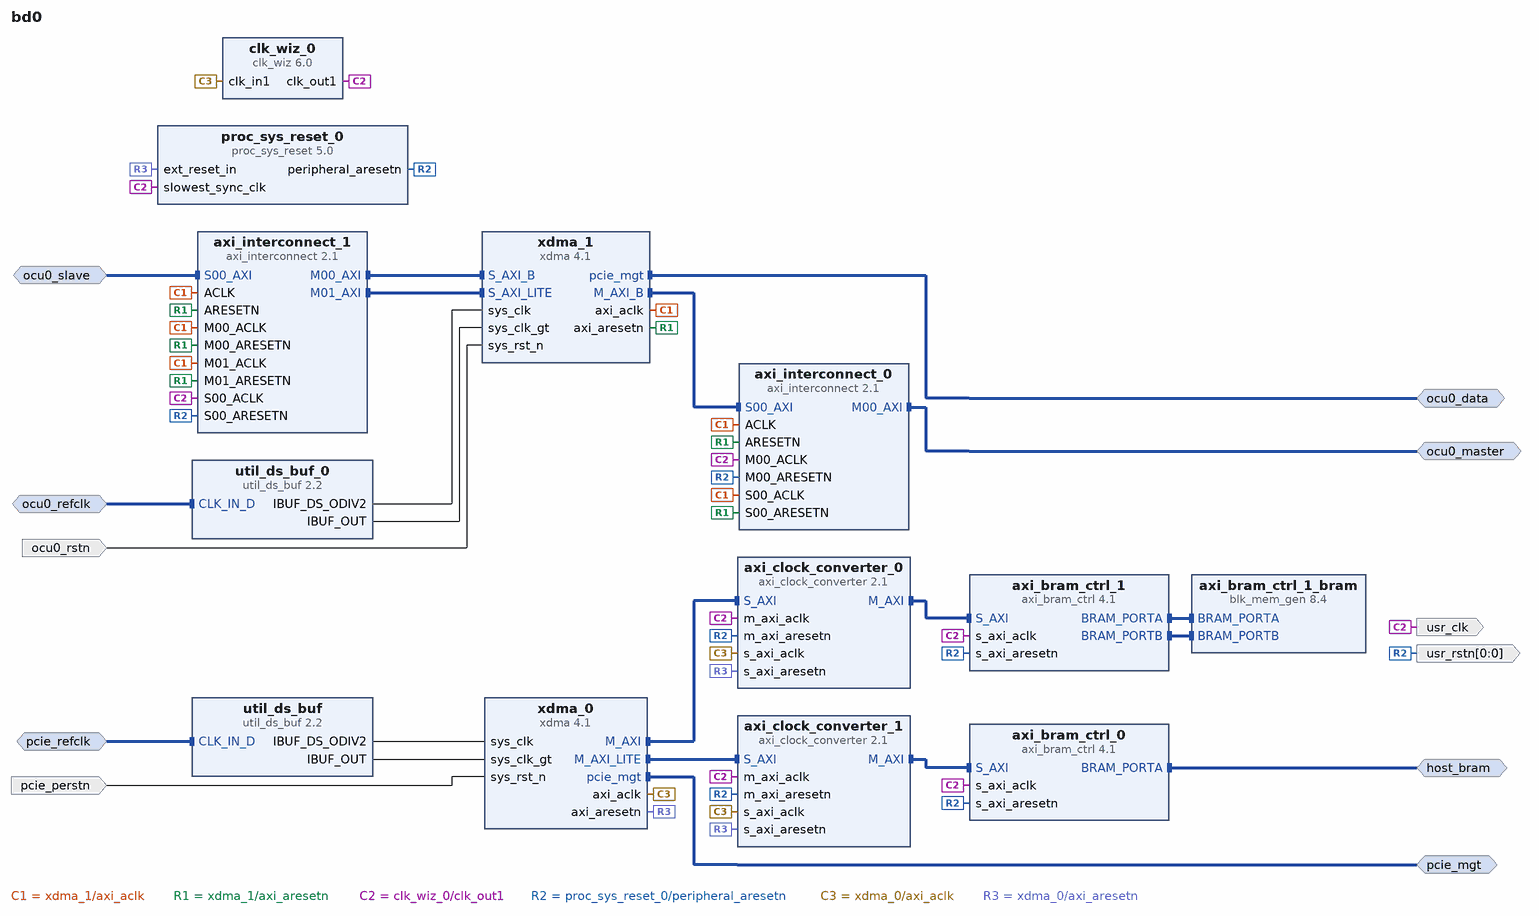
[diagram p0: block diagram of the top level]
# Vivado block design bd0, xczu19eg-ffvd1760-2-e, Vivado 2021.2
create_bd_design bd0

create_bd_intf_port -mode Master -vlnv xilinx.com:interface:pcie_7x_mgt_rtl:1.0 pcie_mgt
create_bd_intf_port -mode Master -vlnv xilinx.com:interface:bram_rtl:1.0 host_bram
set_property -dict {CONFIG.MASTER_TYPE BRAM_CTRL CONFIG.READ_WRITE_MODE READ_WRITE} [get_bd_intf_ports host_bram]
create_bd_intf_port -mode Master -vlnv xilinx.com:interface:pcie_7x_mgt_rtl:1.0 ocu0_data
create_bd_intf_port -mode Master -vlnv xilinx.com:interface:aximm_rtl:1.0 ocu0_master
set_property -dict [list \
  CONFIG.ADDR_WIDTH 64 \
  CONFIG.DATA_WIDTH 128 \
  CONFIG.FREQ_HZ 250000000 \
  CONFIG.HAS_BURST 0 \
  CONFIG.HAS_QOS 0 \
  CONFIG.HAS_REGION 0 \
  CONFIG.NUM_READ_OUTSTANDING 8 \
  CONFIG.NUM_WRITE_OUTSTANDING 8 \
  CONFIG.PROTOCOL AXI4 \
] [get_bd_intf_ports ocu0_master]
create_bd_intf_port -mode Slave -vlnv xilinx.com:interface:aximm_rtl:1.0 ocu0_slave
set_property -dict [list \
  CONFIG.ADDR_WIDTH 64 \
  CONFIG.ARUSER_WIDTH 0 \
  CONFIG.AWUSER_WIDTH 0 \
  CONFIG.BUSER_WIDTH 0 \
  CONFIG.DATA_WIDTH 128 \
  CONFIG.FREQ_HZ 250000000 \
  CONFIG.HAS_BRESP 1 \
  CONFIG.HAS_BURST 1 \
  CONFIG.HAS_CACHE 0 \
  CONFIG.HAS_LOCK 0 \
  CONFIG.HAS_PROT 0 \
  CONFIG.HAS_QOS 0 \
  CONFIG.HAS_REGION 1 \
  CONFIG.HAS_RRESP 1 \
  CONFIG.HAS_WSTRB 1 \
  CONFIG.ID_WIDTH 4 \
  CONFIG.MAX_BURST_LENGTH 256 \
  CONFIG.NUM_READ_OUTSTANDING 8 \
  CONFIG.NUM_READ_THREADS 1 \
  CONFIG.NUM_WRITE_OUTSTANDING 8 \
  CONFIG.NUM_WRITE_THREADS 1 \
  CONFIG.PROTOCOL AXI4 \
  CONFIG.READ_WRITE_MODE READ_WRITE \
  CONFIG.RUSER_BITS_PER_BYTE 0 \
  CONFIG.RUSER_WIDTH 0 \
  CONFIG.SUPPORTS_NARROW_BURST 1 \
  CONFIG.WUSER_BITS_PER_BYTE 0 \
  CONFIG.WUSER_WIDTH 0 \
] [get_bd_intf_ports ocu0_slave]
create_bd_intf_port -mode Slave -vlnv xilinx.com:interface:diff_clock_rtl:1.0 pcie_refclk
set_property -dict {CONFIG.FREQ_HZ 100000000} [get_bd_intf_ports pcie_refclk]
create_bd_intf_port -mode Slave -vlnv xilinx.com:interface:diff_clock_rtl:1.0 ocu0_refclk
create_bd_port -dir I -type rst pcie_perstn
set_property -dict {CONFIG.POLARITY ACTIVE_LOW} [get_bd_ports pcie_perstn]
create_bd_port -dir I -type rst ocu0_rstn
create_bd_port -dir O -type clk usr_clk
set_property -dict {CONFIG.FREQ_HZ 250000000} [get_bd_ports usr_clk]
create_bd_port -dir O -from 0 -to 0 -type rst usr_rstn

create_bd_cell -type ip -vlnv xilinx.com:ip:xdma:4.1 xdma_0
set_property -dict [list \
  CONFIG.axi_data_width 512_bit \
  CONFIG.axilite_master_en true \
  CONFIG.axisten_freq 250 \
  CONFIG.pl_link_cap_max_link_speed 8.0_GT/s \
  CONFIG.pl_link_cap_max_link_width X16 \
  CONFIG.xdma_axi_intf_mm AXI_Memory_Mapped \
] [get_bd_cells xdma_0]
create_bd_cell -type ip -vlnv xilinx.com:ip:util_ds_buf:2.2 util_ds_buf
set_property -dict {CONFIG.C_BUF_TYPE IBUFDSGTE} [get_bd_cells util_ds_buf]
create_bd_cell -type ip -vlnv xilinx.com:ip:axi_bram_ctrl:4.1 axi_bram_ctrl_0
set_property -dict {CONFIG.PROTOCOL AXI4LITE CONFIG.SINGLE_PORT_BRAM 1} [get_bd_cells axi_bram_ctrl_0]
create_bd_cell -type ip -vlnv xilinx.com:ip:axi_bram_ctrl:4.1 axi_bram_ctrl_1
set_property -dict {CONFIG.DATA_WIDTH 512} [get_bd_cells axi_bram_ctrl_1]
create_bd_cell -type ip -vlnv xilinx.com:ip:blk_mem_gen:8.4 axi_bram_ctrl_1_bram
set_property -dict {CONFIG.Memory_Type True_Dual_Port_RAM} [get_bd_cells axi_bram_ctrl_1_bram]
create_bd_cell -type ip -vlnv xilinx.com:ip:xdma:4.1 xdma_1
set_property -dict [list \
  CONFIG.BASEADDR 0x00000000 \
  CONFIG.HIGHADDR 0x001FFFFF \
  CONFIG.PF0_DEVICE_ID_mqdma 9034 \
  CONFIG.PF0_SRIOV_VF_DEVICE_ID A034 \
  CONFIG.PF2_DEVICE_ID_mqdma 9234 \
  CONFIG.PF3_DEVICE_ID_mqdma 9334 \
  CONFIG.axi_addr_width 64 \
  CONFIG.axi_data_width 128_bit \
  CONFIG.axibar_num 1 \
  CONFIG.axisten_freq 250 \
  CONFIG.bridge_burst true \
  CONFIG.c_m_axi_num_write 8 \
  CONFIG.device_port_type Root_Port_of_PCI_Express_Root_Complex \
  CONFIG.dma_reset_source_sel Phy_Ready \
  CONFIG.en_axi_slave_if true \
  CONFIG.en_gt_selection false \
  CONFIG.functional_mode AXI_Bridge \
  CONFIG.mode_selection Basic \
  CONFIG.pcie_blk_locn X0Y3 \
  CONFIG.pf0_bar0_enabled false \
  CONFIG.pf0_bar0_type_mqdma Memory \
  CONFIG.pf0_base_class_menu Bridge_device \
  CONFIG.pf0_base_class_menu_mqdma Bridge_device \
  CONFIG.pf0_class_code_base_mqdma 06 \
  CONFIG.pf0_class_code_interface 00 \
  CONFIG.pf0_class_code_sub 07 \
  CONFIG.pf0_device_id 9134 \
  CONFIG.pf0_link_status_slot_clock_config true \
  CONFIG.pf0_sriov_bar0_type Memory \
  CONFIG.pf0_sub_class_interface_menu CardBus_bridge \
  CONFIG.pf1_bar0_type_mqdma Memory \
  CONFIG.pf1_base_class_menu Bridge_device \
  CONFIG.pf1_base_class_menu_mqdma Bridge_device \
  CONFIG.pf1_class_code_base_mqdma 06 \
  CONFIG.pf1_class_code_interface 00 \
  CONFIG.pf1_class_code_sub 07 \
  CONFIG.pf1_sub_class_interface_menu CardBus_bridge \
  CONFIG.pf2_bar0_type_mqdma Memory \
  CONFIG.pf2_base_class_menu_mqdma Bridge_device \
  CONFIG.pf2_class_code_base_mqdma 06 \
  CONFIG.pf3_bar0_type_mqdma Memory \
  CONFIG.pf3_base_class_menu_mqdma Bridge_device \
  CONFIG.pf3_class_code_base_mqdma 06 \
  CONFIG.pl_link_cap_max_link_speed 8.0_GT/s \
  CONFIG.pl_link_cap_max_link_width X4 \
  CONFIG.plltype QPLL1 \
  CONFIG.type1_membase_memlimit_enable Enabled \
  CONFIG.type1_prefetchable_membase_memlimit 64bit_Enabled \
] [get_bd_cells xdma_1]
create_bd_cell -type ip -vlnv xilinx.com:ip:util_ds_buf:2.2 util_ds_buf_0
set_property -dict {CONFIG.C_BUF_TYPE IBUFDSGTE} [get_bd_cells util_ds_buf_0]
create_bd_cell -type ip -vlnv xilinx.com:ip:axi_interconnect:2.1 axi_interconnect_0
set_property -dict {CONFIG.NUM_MI 1} [get_bd_cells axi_interconnect_0]
create_bd_cell -type ip -vlnv xilinx.com:ip:axi_interconnect:2.1 axi_interconnect_1
set_property -dict {CONFIG.NUM_MI 2 CONFIG.NUM_SI 1} [get_bd_cells axi_interconnect_1]
create_bd_cell -type ip -vlnv xilinx.com:ip:clk_wiz:6.0 clk_wiz_0
set_property -dict [list \
  CONFIG.CLKIN1_JITTER_PS 40.0 \
  CONFIG.CLKOUT1_JITTER 85.152 \
  CONFIG.CLKOUT1_PHASE_ERROR 78.266 \
  CONFIG.CLKOUT1_REQUESTED_OUT_FREQ 250 \
  CONFIG.MMCM_CLKFBOUT_MULT_F 4.750 \
  CONFIG.MMCM_CLKIN1_PERIOD 4.000 \
  CONFIG.MMCM_CLKIN2_PERIOD 10.0 \
  CONFIG.MMCM_CLKOUT0_DIVIDE_F 4.750 \
  CONFIG.USE_LOCKED false \
  CONFIG.USE_RESET false \
] [get_bd_cells clk_wiz_0]
create_bd_cell -type ip -vlnv xilinx.com:ip:axi_clock_converter:2.1 axi_clock_converter_0
create_bd_cell -type ip -vlnv xilinx.com:ip:axi_clock_converter:2.1 axi_clock_converter_1
create_bd_cell -type ip -vlnv xilinx.com:ip:proc_sys_reset:5.0 proc_sys_reset_0

# ---- connections ----

connect_bd_intf_net -intf_net CLK_IN_D_0_1 [get_bd_intf_ports ocu0_refclk] [get_bd_intf_pins util_ds_buf_0/CLK_IN_D]
connect_bd_intf_net [get_bd_intf_pins axi_interconnect_0/S00_AXI] [get_bd_intf_pins xdma_1/M_AXI_B]
connect_bd_intf_net [get_bd_intf_ports host_bram] [get_bd_intf_pins axi_bram_ctrl_0/BRAM_PORTA]
connect_bd_intf_net [get_bd_intf_pins axi_bram_ctrl_1_bram/BRAM_PORTA] [get_bd_intf_pins axi_bram_ctrl_1/BRAM_PORTA]
connect_bd_intf_net [get_bd_intf_pins axi_bram_ctrl_1_bram/BRAM_PORTB] [get_bd_intf_pins axi_bram_ctrl_1/BRAM_PORTB]
connect_bd_intf_net [get_bd_intf_pins axi_clock_converter_0/M_AXI] [get_bd_intf_pins axi_bram_ctrl_1/S_AXI]
connect_bd_intf_net [get_bd_intf_pins axi_bram_ctrl_0/S_AXI] [get_bd_intf_pins axi_clock_converter_1/M_AXI]
connect_bd_intf_net [get_bd_intf_ports ocu0_master] [get_bd_intf_pins axi_interconnect_0/M00_AXI]
connect_bd_intf_net [get_bd_intf_pins axi_interconnect_1/M00_AXI] [get_bd_intf_pins xdma_1/S_AXI_B]
connect_bd_intf_net [get_bd_intf_pins axi_interconnect_1/M01_AXI] [get_bd_intf_pins xdma_1/S_AXI_LITE]
connect_bd_intf_net -intf_net diff_clock_rtl_0_1 [get_bd_intf_ports pcie_refclk] [get_bd_intf_pins util_ds_buf/CLK_IN_D]
connect_bd_intf_net [get_bd_intf_ports ocu0_slave] [get_bd_intf_pins axi_interconnect_1/S00_AXI]
connect_bd_intf_net [get_bd_intf_pins xdma_0/M_AXI] [get_bd_intf_pins axi_clock_converter_0/S_AXI]
connect_bd_intf_net [get_bd_intf_pins xdma_0/M_AXI_LITE] [get_bd_intf_pins axi_clock_converter_1/S_AXI]
connect_bd_intf_net [get_bd_intf_ports pcie_mgt] [get_bd_intf_pins xdma_0/pcie_mgt]
connect_bd_intf_net [get_bd_intf_ports ocu0_data] [get_bd_intf_pins xdma_1/pcie_mgt]
connect_bd_net -net S00_ACLK_1 [get_bd_pins xdma_1/axi_aclk] \
  [get_bd_pins axi_interconnect_0/S00_ACLK] [get_bd_pins axi_interconnect_1/M00_ACLK] \
  [get_bd_pins axi_interconnect_1/M01_ACLK] [get_bd_pins axi_interconnect_0/ACLK] [get_bd_pins axi_interconnect_1/ACLK]
connect_bd_net -net S00_ARESETN_1 [get_bd_pins xdma_1/axi_aresetn] \
  [get_bd_pins axi_interconnect_0/S00_ARESETN] [get_bd_pins axi_interconnect_1/M00_ARESETN] \
  [get_bd_pins axi_interconnect_1/M01_ARESETN] [get_bd_pins axi_interconnect_0/ARESETN] \
  [get_bd_pins axi_interconnect_1/ARESETN]
connect_bd_net [get_bd_pins clk_wiz_0/clk_out1] \
  [get_bd_ports usr_clk] [get_bd_pins axi_clock_converter_0/m_axi_aclk] [get_bd_pins axi_bram_ctrl_1/s_axi_aclk] \
  [get_bd_pins axi_clock_converter_1/m_axi_aclk] [get_bd_pins axi_bram_ctrl_0/s_axi_aclk] \
  [get_bd_pins axi_interconnect_1/S00_ACLK] [get_bd_pins axi_interconnect_0/M00_ACLK] \
  [get_bd_pins proc_sys_reset_0/slowest_sync_clk]
connect_bd_net -net proc_sys_reset_0_interconnect_aresetn [get_bd_pins proc_sys_reset_0/peripheral_aresetn] \
  [get_bd_pins axi_clock_converter_1/m_axi_aresetn] [get_bd_pins axi_clock_converter_0/m_axi_aresetn] \
  [get_bd_pins axi_bram_ctrl_1/s_axi_aresetn] [get_bd_pins axi_bram_ctrl_0/s_axi_aresetn] [get_bd_ports usr_rstn] \
  [get_bd_pins axi_interconnect_0/M00_ARESETN] [get_bd_pins axi_interconnect_1/S00_ARESETN]
connect_bd_net -net reset_rtl_0_1 [get_bd_ports pcie_perstn] [get_bd_pins xdma_0/sys_rst_n]
connect_bd_net -net sys_rst_n_0_1 [get_bd_ports ocu0_rstn] [get_bd_pins xdma_1/sys_rst_n]
connect_bd_net [get_bd_pins util_ds_buf_0/IBUF_DS_ODIV2] [get_bd_pins xdma_1/sys_clk]
connect_bd_net [get_bd_pins util_ds_buf_0/IBUF_OUT] [get_bd_pins xdma_1/sys_clk_gt]
connect_bd_net [get_bd_pins util_ds_buf/IBUF_DS_ODIV2] [get_bd_pins xdma_0/sys_clk]
connect_bd_net [get_bd_pins util_ds_buf/IBUF_OUT] [get_bd_pins xdma_0/sys_clk_gt]
connect_bd_net [get_bd_pins xdma_0/axi_aclk] \
  [get_bd_pins clk_wiz_0/clk_in1] [get_bd_pins axi_clock_converter_0/s_axi_aclk] \
  [get_bd_pins axi_clock_converter_1/s_axi_aclk]
connect_bd_net [get_bd_pins xdma_0/axi_aresetn] \
  [get_bd_pins axi_clock_converter_0/s_axi_aresetn] [get_bd_pins axi_clock_converter_1/s_axi_aresetn] \
  [get_bd_pins proc_sys_reset_0/ext_reset_in]

# ---- address map ----
assign_bd_address -offset 0x0000000000000000 -range 4G -target_address_space [get_bd_addr_spaces ocu0_slave] [get_bd_addr_segs xdma_1/S_AXI_B/BAR0]
assign_bd_address -offset 0x0000000100000000 -range 4G -target_address_space [get_bd_addr_spaces ocu0_slave] [get_bd_addr_segs xdma_1/S_AXI_LITE/CTL0]
assign_bd_address -offset 0x0000000000000000 -range 16E -target_address_space [get_bd_addr_spaces xdma_0/M_AXI] [get_bd_addr_segs axi_bram_ctrl_1/S_AXI/Mem0]
assign_bd_address -offset 0x00000000 -range 4G -target_address_space [get_bd_addr_spaces xdma_0/M_AXI_LITE] [get_bd_addr_segs axi_bram_ctrl_0/S_AXI/Mem0]
assign_bd_address -offset 0x0000000000000000 -range 16E -target_address_space [get_bd_addr_spaces xdma_1/M_AXI_B] [get_bd_addr_segs ocu0_master/Reg]

validate_bd_design
save_bd_design
